# Altium schematic sheet Sensor_Speed.SchDoc
size A4
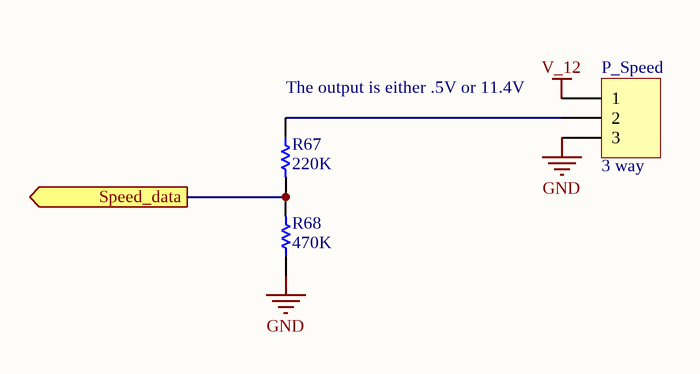
[diagram p0: Sensor_Speed.SchDoc]

## Parts
P_Speed  3 way  [Con_3way_0.1]
R67  220K  [R0603]
R68  470K  [R0603]

## Ports
Speed_data (out)

## Nets
GND: P_Speed.3 R68.1
V_12: P_Speed.1
Speed_data: R67.2 R68.2 ; port Speed_data
NetP_Speed_2: P_Speed.2 R67.1

## Notes on the sheet
- The output is either .5V or 11.4V

## Library data of the parts
P_Speed = Con3ra100ml: 3 way upright Locking & Polarising Header Connector; ECE_Component_Code: Con3ra100ml; Supplier_Component_Code: HM-3413; published: 27/09/2006; Supplier_Name: Soanar Plus; price: 0.1; value: 3 way; Part Number: Con3ra100ml; Component Kind: Standard; Component Type: Standard; Designator: Con3ra100ml; Pin Count: 3
R67 = 220K_R0603: 0603 Resistor; ECE_Component_Code: 220K_R0603; value: 220K; Supplier_Component_Code: RS-S129; published: 12/03/2007 11:34:34 a.m.; Supplier_Name: Soanar Plus; price: 0.08; Part Number: 220K_R0603; Component Kind: Standard; Component Type: Standard; Designator: 220K_R0603; Pin Count: 2
R68 = 470K_R0603: 0603 Resistor; ECE_Component_Code: 470K_R0603; value: 470K; Supplier_Component_Code: RS-S137; published: 12/03/2007 11:34:34 a.m.; Supplier_Name: Soanar Plus; price: 0.08; Part Number: 470K_R0603; Component Kind: Standard; Component Type: Standard; Designator: 470K_R0603; Pin Count: 2